# Altium schematic sheet Analog - High Speed DE.SchDoc: Analog - High Speed Differential
size B; DrawnBy: Jasper Yun; SheetNumber: 10; SheetTotal: 13; Competition: SAC 2021; Subteam: Avionics; University: McGill University; Location: Montreal, Quebec; Project: Avionics Project Name; MRT: McGill Rocket Team
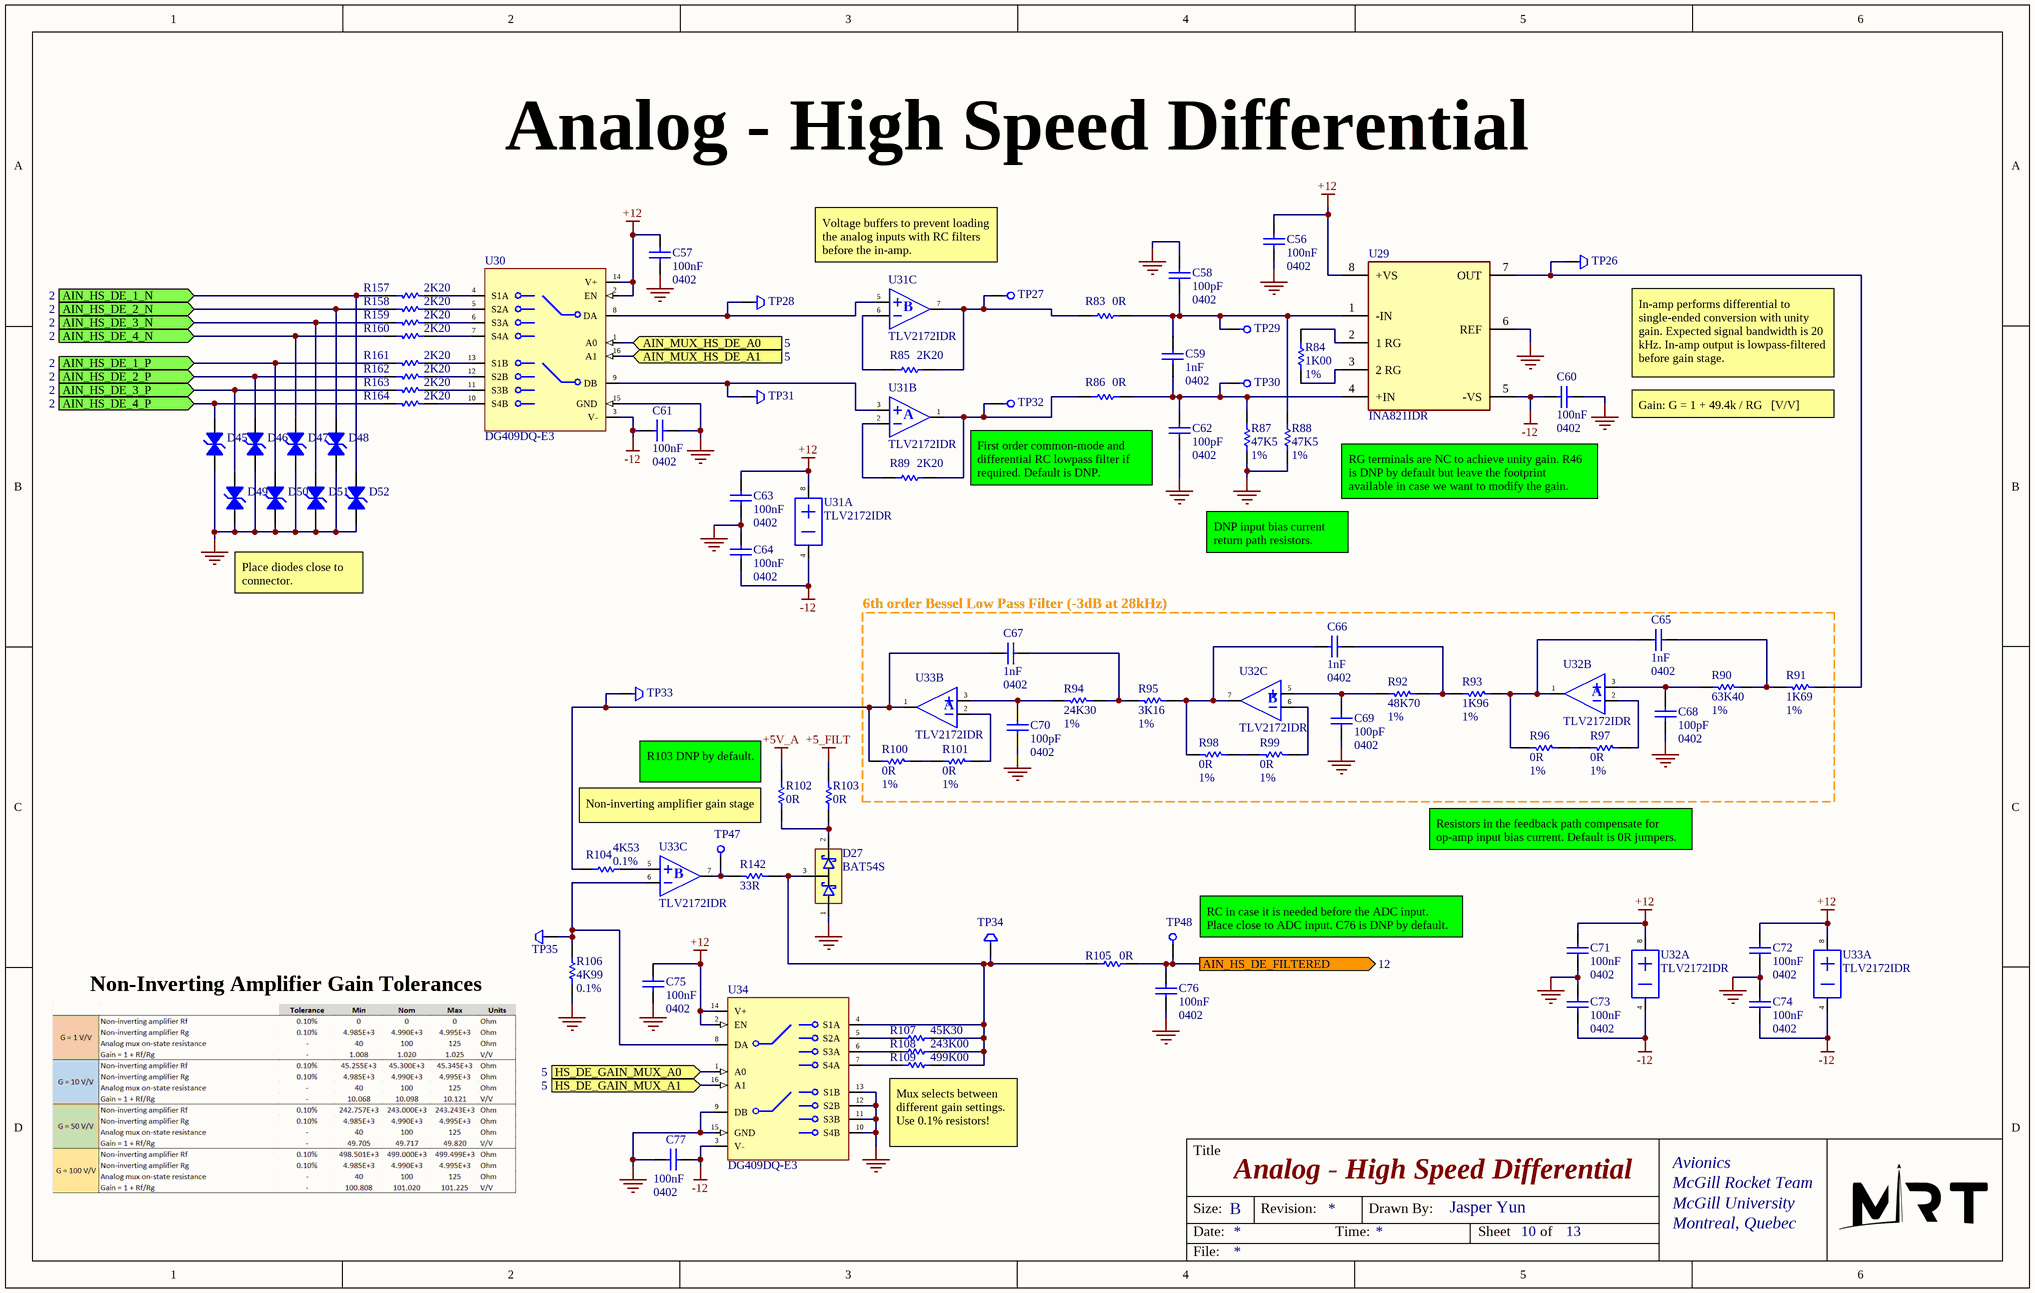
[diagram p0: Analog - High Speed DE.SchDoc]

## Parts
C56  100nF  value 0402  [0402 CAP]
C57  100nF  value 0402  [0402 CAP]
C58  100pF  value 0402  [0402 CAP]
C59  1nF  value 0402  [0402 CAP]
C60  100nF  value 0402  [0402 CAP]
C61  100nF  value 0402  [0402 CAP]
C62  100pF  value 0402  [0402 CAP]
C63  100nF  value 0402  [0402 CAP]
C64  100nF  value 0402  [0402 CAP]
C65  1nF  value 0402  [0402 CAP]
C66  1nF  value 0402  [0402 CAP]
C67  1nF  value 0402  [0402 CAP]
C68  100pF  value 0402  [0402 CAP]
C69  100pF  value 0402  [0402 CAP]
C70  100pF  value 0402  [0402 CAP]
C71  100nF  value 0402  [0402 CAP]
C72  100nF  value 0402  [0402 CAP]
C73  100nF  value 0402  [0402 CAP]
C74  100nF  value 0402  [0402 CAP]
C75  100nF  value 0402  [0402 CAP]
C76  100nF  value 0402  [0402 CAP]
C77  100nF  value 0402  [0402 CAP]
D27  BAT54S  [SOT23-3]
D45  D12V0L1B2LP-7B  [DFN1006-2]  (value not drawn)
D46  D12V0L1B2LP-7B  [DFN1006-2]  (value not drawn)
D47  D12V0L1B2LP-7B  [DFN1006-2]  (value not drawn)
D48  D12V0L1B2LP-7B  [DFN1006-2]  (value not drawn)
D49  D12V0L1B2LP-7B  [DFN1006-2]  (value not drawn)
D50  D12V0L1B2LP-7B  [DFN1006-2]  (value not drawn)
D51  D12V0L1B2LP-7B  [DFN1006-2]  (value not drawn)
D52  D12V0L1B2LP-7B  [DFN1006-2]  (value not drawn)
R83  0R  [0402 RES]
R84  1K00  value 1%  [0402 RES]
R85  2K20  [0402 RES]
R86  0R  [0402 RES]
R87  47K5  value 1%  [0402 RES]
R88  47K5  value 1%  [0402 RES]
R89  2K20  [0402 RES]
R90  63K40  value 1%  [0402 RES]
R91  1K69  value 1%  [0402 RES]
R92  48K70  value 1%  [0402 RES]
R93  1K96  value 1%  [0402 RES]
R94  24K30  value 1%  [0402 RES]
R95  3K16  value 1%  [0402 RES]
R96  0R  value 1%  [0402 RES]
R97  0R  value 1%  [0402 RES]
R98  0R  value 1%  [0402 RES]
R99  0R  value 1%  [0402 RES]
R100  0R  value 1%  [0402 RES]
R101  0R  value 1%  [0402 RES]
R102  0R  [0402 RES]
R103  0R  [0402 RES]
R104  4K53  value 0.1%  [0402 RES]
R105  0R  [0402 RES]
R106  4K99  value 0.1%  [0402 RES]
R107  45K30  [0402 RES]
R108  243K00  [0402 RES]
R109  499K00  [0402 RES]
R142  33R  [0402 RES]
R157  2K20  [0402 RES]
R158  2K20  [0402 RES]
R159  2K20  [0402 RES]
R160  2K20  [0402 RES]
R161  2K20  [0402 RES]
R162  2K20  [0402 RES]
R163  2K20  [0402 RES]
R164  2K20  [0402 RES]
TP26  Test Point - Keystone 5015  [Test Point Keystone 5015]  (value not drawn)
TP27  Test Point - SMD Pad  [TEST POINT SMD PAD]  (value not drawn)  (no BOM)
TP28  Test Point - Keystone 5015  [Test Point Keystone 5015]  (value not drawn)
TP29  Test Point - SMD Pad  [TEST POINT SMD PAD]  (value not drawn)  (no BOM)
TP30  Test Point - SMD Pad  [TEST POINT SMD PAD]  (value not drawn)  (no BOM)
TP31  Test Point - Keystone 5015  [Test Point Keystone 5015]  (value not drawn)
TP32  Test Point - SMD Pad  [TEST POINT SMD PAD]  (value not drawn)  (no BOM)
TP33  Test Point - Keystone 5015  [Test Point Keystone 5015]  (value not drawn)
TP34  Test Point - Keystone 5015  [Test Point Keystone 5015]  (value not drawn)
TP35  Test Point - Keystone 5015  [Test Point Keystone 5015]  (value not drawn)
TP47  Test Point - SMD Pad  [TEST POINT SMD PAD]  (value not drawn)  (no BOM)
TP48  Test Point - SMD Pad  [TEST POINT SMD PAD]  (value not drawn)  (no BOM)
U29  INA821IDR  [FP-D0008A-IPC_A]
U30  DG409DQ-E3  [TSSOP-16]
U31  TLV2172IDR  [SOIC-8]  (parts A,B,C of 3)
U32  TLV2172IDR  [SOIC-8]  (parts A,B,C of 3)
U33  TLV2172IDR  [SOIC-8]  (parts A,B,C of 3)
U34  DG409DQ-E3  [TSSOP-16]

## Blocks framed on the sheet
6th order Bessel Low Pass Filter (-3dB at 28kHz): C65-C70 R90-R101 U32 U33

## Ports
AIN_HS_DE_1_N (in, see 2), AIN_HS_DE_1_P (in, see 2), AIN_HS_DE_2_N (in, see 2), AIN_HS_DE_2_P (in, see 2), AIN_HS_DE_3_N (in, see 2), AIN_HS_DE_3_P (in, see 2), AIN_HS_DE_4_N (in, see 2), AIN_HS_DE_4_P (in, see 2), AIN_HS_DE_FILTERED (out, see 12), AIN_MUX_HS_DE_A0 (in, see 5), AIN_MUX_HS_DE_A1 (in, see 5), HS_DE_GAIN_MUX_A0 (in, see 5), HS_DE_GAIN_MUX_A1 (in, see 5)

## Nets
+5_FILT: R103.1
+5V_A: R102.1
+12: C56.2 C57.2 C63.2 C71.2 C72.2 C75.2 U29.8(+VS) U30.2(EN) U30.14(V+) U31.8(VCC+) U32.8(VCC+) U33.8(VCC+) U34.2(EN) U34.14(V+)
-12: C60.2 C61.2 C64.1 C73.1 C74.1 C77.2 U29.5(-VS) U30.3(V-) U31.4(VCC-) U32.4(VCC-) U33.4(VCC-) U34.3(V-)
GND: C56.1 C57.1 C58.2 C60.1 C61.1 C62.1 C63.1 C64.2 C68.1 C69.1 C70.1 C71.1 C72.1 C73.2 C74.2 C75.1 C76.1 C77.1 D27.1 D45.1 D46.1 D47.1 D48.1 D49.1 D50.1 D51.1 D52.1 R87.1 R88.1 R106.1 U29.6(REF) U30.15(GND) U34.9(DB) U34.10(S4B) U34.11(S3B) U34.12(S2B) U34.13(S1B) U34.15(GND)
AIN_HS_DE_1_N: D52.2 R157.1 ; port AIN_HS_DE_1_N
AIN_HS_DE_1_P: D50.2 R161.1 ; port AIN_HS_DE_1_P
AIN_HS_DE_2_N: D48.2 R158.1 ; port AIN_HS_DE_2_N
AIN_HS_DE_2_P: D46.2 R162.1 ; port AIN_HS_DE_2_P
AIN_HS_DE_3_N: D51.2 R159.1 ; port AIN_HS_DE_3_N
AIN_HS_DE_3_P: D49.2 R163.1 ; port AIN_HS_DE_3_P
AIN_HS_DE_4_N: D47.2 R160.1 ; port AIN_HS_DE_4_N
AIN_HS_DE_4_P: D45.2 R164.1 ; port AIN_HS_DE_4_P
AIN_HS_DE_FILTERED: C76.2 R105.1 TP48.1 ; port AIN_HS_DE_FILTERED
AIN_MUX_HS_DE_A0: U30.1(A0) ; port AIN_MUX_HS_DE_A0
AIN_MUX_HS_DE_A1: U30.16(A1) ; port AIN_MUX_HS_DE_A1
HS_DE_GAIN_MUX_A0: U34.1(A0) ; port HS_DE_GAIN_MUX_A0
HS_DE_GAIN_MUX_A1: U34.16(A1) ; port HS_DE_GAIN_MUX_A1
NetC58_1: C58.1 C59.2 R83.1 R88.2 TP29.1 U29.1(-IN)
NetC59_1: C59.1 C62.2 R86.1 R87.2 TP30.1 U29.4(+IN)
NetC65_1: C65.1 R93.1 R96.2 U32.1
NetC65_2: C65.2 R90.1 R91.2
NetC66_1: C66.1 R95.1 R98.2 U32.7
NetC66_2: C66.2 R92.1 R93.2
NetC67_1: C67.1 R100.2 R104.2 TP33.1 U33.1
NetC67_2: C67.2 R94.1 R95.2
NetC68_2: C68.2 R90.2 U32.3
NetC69_2: C69.2 R92.2 U32.5
NetC70_2: C70.2 R94.2 U33.3
NetD27_2: D27.2 R102.2 R103.2
NetD27_3: D27.3 R105.2 R107.1 R108.1 R109.1 R142.2 TP34.1 U34.4(S1A)
NetR83_2: R83.2 R85.1 TP27.1 U31.7
NetR84_1: R84.1 U29.3(2_RG)
NetR84_2: R84.2 U29.2(1_RG)
NetR85_2: R85.2 U31.6
NetR86_2: R86.2 R89.1 TP32.1 U31.1
NetR89_2: R89.2 U31.2
NetR91_1: R91.1 TP26.1 U29.7(OUT)
NetR96_1: R96.1 R97.2
NetR97_1: R97.1 U32.2
NetR98_1: R98.1 R99.2
NetR99_1: R99.1 U32.6
NetR100_1: R100.1 R101.2
NetR101_1: R101.1 U33.2
NetR104_1: R104.1 U33.5
NetR106_2: R106.2 TP35.1 U33.6 U34.8(DA)
NetR107_2: R107.2 U34.5(S2A)
NetR108_2: R108.2 U34.6(S3A)
NetR109_2: R109.2 U34.7(S4A)
NetR142_1: R142.1 TP47.1 U33.7
NetR157_2: R157.2 U30.4(S1A)
NetR158_2: R158.2 U30.5(S2A)
NetR159_2: R159.2 U30.6(S3A)
NetR160_2: R160.2 U30.7(S4A)
NetR161_2: R161.2 U30.13(S1B)
NetR162_2: R162.2 U30.12(S2B)
NetR163_2: R163.2 U30.11(S3B)
NetR164_2: R164.2 U30.10(S4B)
NetTP28_1: TP28.1 U30.8(DA) U31.5
NetTP31_1: TP31.1 U30.9(DB) U31.3

## Notes on the sheet
- Voltage buffers to prevent loading the analog inputs with RC filters before the in-amp.
- In-amp performs differential to single-ended conversion with unity gain. Expected signal bandwidth is 20 kHz. In-amp output is lowpass-filtered before gain stage.
- Gain: G = 1 + 49.4k / RG   [V/V]
- First order common-mode and differential RC lowpass filter if required. Default is DNP.
- RG terminals are NC to achieve unity gain. R46 is DNP by default but leave the footprint available in case we want to modify the gain.
- DNP input bias current return path resistors.
- Place diodes close to connector.
- (near R102) R103 DNP by default.
- Non-inverting amplifier gain stage
- Resistors in the feedback path compensate for op-amp input bias current. Default is 0R jumpers.
- (near TP48) RC in case it is needed before the ADC input. Place close to ADC input. C76 is DNP by default.
- Non-Inverting Amplifier Gain Tolerances
- (near R109) Mux selects between different gain settings.
  Use 0.1% resistors!
- Title
- Size:
- Date:
- B
- Revision:
- Time:
- Drawn By:
- Sheet
- of
- File:
- (in symbol OP AMP RC4580, part B) A
- (in symbol OP AMP RC4580, part C) B

## Library data of the parts
C56-C77 = Cap: Capacitor; Published: 8-Jun-2000; LatestRevisionDate: 17-Jul-2002; LatestRevisionNote: Re-released for DXP Platform.; PackageReference: RAD-0.3; Publisher: Altium Limited; PackageDescription: Radial Cap, Thru-Hole; 2 Leads; 0.3 in Pin Spacing
D27 = Schottky Diode Array BAT54S: Rectifier Diode Small Signal Schottky 40V 0.3A 5ns 3-Pin SOT-23 T/R; Manufacturer: STMicroelectronics; Manufacturer Part Number: BAT54SFILM; Forward Current: 300mA; Peak Non-Repetitive Surge Current: 1A; Forward Voltage: 900mV; Max Reverse Current: 100uA; Max Reverse Leakage Current: 1uA; Element Configuration: Single; Voltage Rating (DC): 30V; Supplier 1: Digi-Key; RoHS: Yes; Category: Rectifier Diodes; Stock 1: 2760; Pricing 1: 1=0.34000, 10=0.27800, 100=0.14730, 500=0.09694, 1000=0.06592 (USD); Mount: Surface Mount; Case/Package: SOT-23; Number of Pins: 3; Weight: 0.1lb; Min Operating Temperature: -40°C; Max Operating Temperature: 150°C; Reverse Recovery Time: 5ns; Max Repetitive Reverse Voltage (Vrrm): 40V; Packaging: Tape and Reel; Package Quantity: 3000; Average Rectified Current: 300mA; Max Forward Surge Current (Ifsm): 1A; Max Reverse Voltage (DC): 40V; Max Surge Current: 1A; Recovery Time: 5ns; Termination: SMD/SMT; Current Rating: 300mA; Length: 2.9mm; Width: 3.05mm; Height: 0.95mm; Radiation Hardening: No; REACH SVHC: No SVHC; RoHS Compliant: Yes; Lead Free: Lead Free; ComponentLink1URL: https://datasheet.ciiva.com/1200/1689724-1200683.pdf?src-supplier=Farnell; ComponentLink1Description: https://datasheet.ciiva.com/1200/1689724-1200683.pdf?src-supplier=Farnell; ComponentLink2URL: https://datasheet.ciiva.com/1177/1689724-1177974.pdf?src-supplier=Element14; ComponentLink2Description: https://datasheet.ciiva.com/1177/1689724-1177974.pdf?src-supplier=Element14; ComponentLink3URL: https://datasheet.ciiva.com/1200/cd00001322-1200682.pdf?src-supplier=Farnell; ComponentLink3Description: https://datasheet.ciiva.com/1200/cd00001322-1200682.pdf?src-supplier=Farnell; ComponentLink4URL: https://datasheet.ciiva.com/14168/cd00001322-14168028.pdf?src-supplier=Distrelec; ComponentLink4Description: https://datasheet.ciiva.com/14168/cd00001322-14168028.pdf?src-supplier=Distrelec; ComponentLink5URL: https://datasheet.ciiva.com/905/cd00001322-905882.pdf?src-supplier=Digi-Key; ComponentLink5Description: https://datasheet.ciiva.com/905/cd00001322-905882.pdf?src-supplier=Digi-Key; ComponentLink6URL: https://datasheet.ciiva.com/905/cd00001322-905881.pdf?src-supplier=Digi-Key; ComponentLink6Description: https://datasheet.ciiva.com/905/cd00001322-905881.pdf?src-supplier=Digi-Key; ComponentLink7URL: https://datasheet.ciiva.com/905/cd00001322-905883.pdf?src-supplier=Digi-Key; ComponentLink7Description: https://datasheet.ciiva.com/905/cd00001322-905883.pdf?src-supplier=Digi-Key; ComponentLink8URL: https://datasheet.ciiva.com/1177/1689724-1177973.pdf?src-supplier=Element14; ComponentLink8Description: https://datasheet.ciiva.com/1177/1689724-1177973.pdf?src-supplier=Element14; Supplier Part Number 1: 497-2522-1-ND
D45-D52 = Diode Zener Bidirectional: Bidirectional Zener diode
R83 R85 R86 R89 R102 R103 R105 R107-R109 R142 R157-R164 = Res1: Resistor; Value: 1%; Published: 8-Jun-2000; LatestRevisionDate: 17-Jul-2002; LatestRevisionNote: Re-released for DXP Platform.; PackageReference: AXIAL-0.3; Publisher: Altium Limited; PackageDescription: Axial Device, Thru-Hole; 2 Leads; 0.3 in Pin Spacing
R84 R87 R88 R90-R101 R104 R106 = Res1: Resistor; Published: 8-Jun-2000; LatestRevisionDate: 17-Jul-2002; LatestRevisionNote: Re-released for DXP Platform.; PackageReference: AXIAL-0.3; Publisher: Altium Limited; PackageDescription: Axial Device, Thru-Hole; 2 Leads; 0.3 in Pin Spacing
TP26 TP28 TP31 TP33-TP35 = Test Point - Keystone 5015: Keystone 5015 Test point
TP27 TP29 TP30 TP32 TP47 TP48 = Test Point - SMD Pad: SMD Pad test point
U29 = CMP-04895-000157-1: IC INST AMP 1 CIRCUIT 8SOIC; RoHS Compliant: Yes
U30 U34 = Analog Mux DG409DQ-E3: DG409 Series 20 V 8-Ch/Dual 4-Ch High-Performance CMOS Analog Multiplexer; Manufacturer: Vishay Siliconix; Min Supply Voltage: 13V; Max Supply Voltage: 44V; Number of Inputs: 8; Number of Outputs: 2; Number of Channels: 4; Min Dual Supply Voltage: 5V; Max Dual Supply Voltage: 20V; Propagation Delay: 160ns; On-State Resistance: 90R; Operating Supply Current: 1uA; Turn-On Delay Time: 150ns; Max Power Dissipation: 600mW; Max Supply Current: 500uA; Supply Type: Dual,Single; Dual Supply Voltage: 15V; Operating Supply Voltage: 36V; Supplier 1: Mouser; Manufacturer Part Number: DG409DQ-E3; RoHS: Yes; Category: Decoders and Multiplexers; Stock 1: 4584; Pricing 1: 1=4.36000, 10=3.91000, 50=3.70000, 100=3.20000, 1000=2.73000, 10000=2.40000 (USD); Mount: Surface Mount; Case/Package: TSSOP; Number of Pins: 16; Weight: 0.006102oz; Min Operating Temperature: -40°C; Max Operating Temperature: 85°C; Package Quantity: 360; Packaging: Rail/Tube; Logic Function: Multiplexer; Turn-Off Delay Time: 150ns; Power Dissipation: 600mW; Series: -; Length: 5.07mm; Width: 4.4mm; Height: 0.92mm; Radiation Hardening: No; Lead Free: Lead Free; RoHS Compliant: Yes; ComponentLink1URL: https://datasheet.ciiva.com/1677/dg408-1677556.pdf?src-supplier=Digi-Key; ComponentLink1Description: https://datasheet.ciiva.com/1677/dg408-1677556.pdf?src-supplier=Digi-Key; ComponentLink2URL: https://datasheet.ciiva.com/2978/dg408-2978747.pdf?src-supplier=Avnet; ComponentLink2Description: https://datasheet.ciiva.com/2978/dg408-2978747.pdf?src-supplier=Avnet; Supplier Part Number 1: 78-DG409DQ-E3
U31-U33 = OP AMP RC4580: 2-channel, 12-MHz, low-noise, low-distortion audio op amp with high output current 8-SOIC -40 to 85; Manufacturer: Texas Instruments; Manufacturer Part Number: RC4580IDR; Min Supply Voltage: 4V; Max Supply Voltage: 32V; Max Dual Supply Voltage: 16V; Min Dual Supply Voltage: 2V; Voltage Gain: 110dB; Common Mode Rejection Ratio: 80dB; Nominal Gain Bandwidth Product: 12MHz; Number of Channels: 2; Slew Rate: 5V/µs; Max I/O Voltage: 3mV; Input Bias Current: 500nA; Operating Supply Current: 6mA; Output Current per Channel: 50mA; Nominal Supply Current: 4.5mA; Dual Supply Voltage: 9V; Load Impedance: 2kR; Supplier 1: Digi-Key; RoHS: Yes; Category: Amplifiers - Op Amps, Buffer, Instrumentation; Stock 1: 3503; Pricing 1: 1=0.46000, 10=0.37400, 25=0.34200, 100=0.25460, 250=0.23072, 500=0.19092, 1000=0.14320 (USD); Case/Package: D; Number of Pins: 8; Weight: 0.002561oz; Contact Plating: Gold; Min Operating Temperature: -40°C; Max Operating Temperature: 85°C; Packaging: Tape and Reel; Package Quantity: 1; Number of Circuits: 2; Gain Bandwidth Product: 12MHz; Input Offset Voltage (Vos): 3mV; Series: -; Supply Current: 4.5mA; Bandwidth: 12MHz; Unity Gain Bandwidth Product: 12MHz; Number of Elements: 2; Technology: BIPOLAR; Radiation Hardening: No; Lead Free: Lead Free; RoHS Compliant: Yes; Reach SVHC Compliant: No SVHC; ComponentLink1URL: https://datasheet.ciiva.com/23806/1716592-23806563.pdf?src-supplier=Newark; ComponentLink1Description: https://datasheet.ciiva.com/23806/1716592-23806563.pdf?src-supplier=Newark; ComponentLink2URL: https://datasheet.ciiva.com/22654/1882301-22654837.pdf?src-supplier=Element14; ComponentLink2Description: https://datasheet.ciiva.com/22654/1882301-22654837.pdf?src-supplier=Element14; ComponentLink3URL: https://datasheet.ciiva.com/46382/1840282-46382300.pdf?src-supplier=Element14; ComponentLink3Description: https://datasheet.ciiva.com/46382/1840282-46382300.pdf?src-supplier=Element14; ComponentLink4URL: https://datasheet.ciiva.com/1796/rc4580-1796261.pdf?src-supplier=Digi-Key; ComponentLink4Description: https://datasheet.ciiva.com/1796/rc4580-1796261.pdf?src-supplier=Digi-Key; ComponentLink5URL: https://datasheet.ciiva.com/1796/rc4580-1796260.pdf?src-supplier=Digi-Key; ComponentLink5Description: https://datasheet.ciiva.com/1796/rc4580-1796260.pdf?src-supplier=Digi-Key; ComponentLink6URL: https://datasheet.ciiva.com/1796/rc4580-1796262.pdf?src-supplier=Digi-Key; ComponentLink6Description: https://datasheet.ciiva.com/1796/rc4580-1796262.pdf?src-supplier=Digi-Key; Supplier Part Number 1: 296-15367-1-ND